# EAGLE design H-bro_gear (EAGLE 6.3)
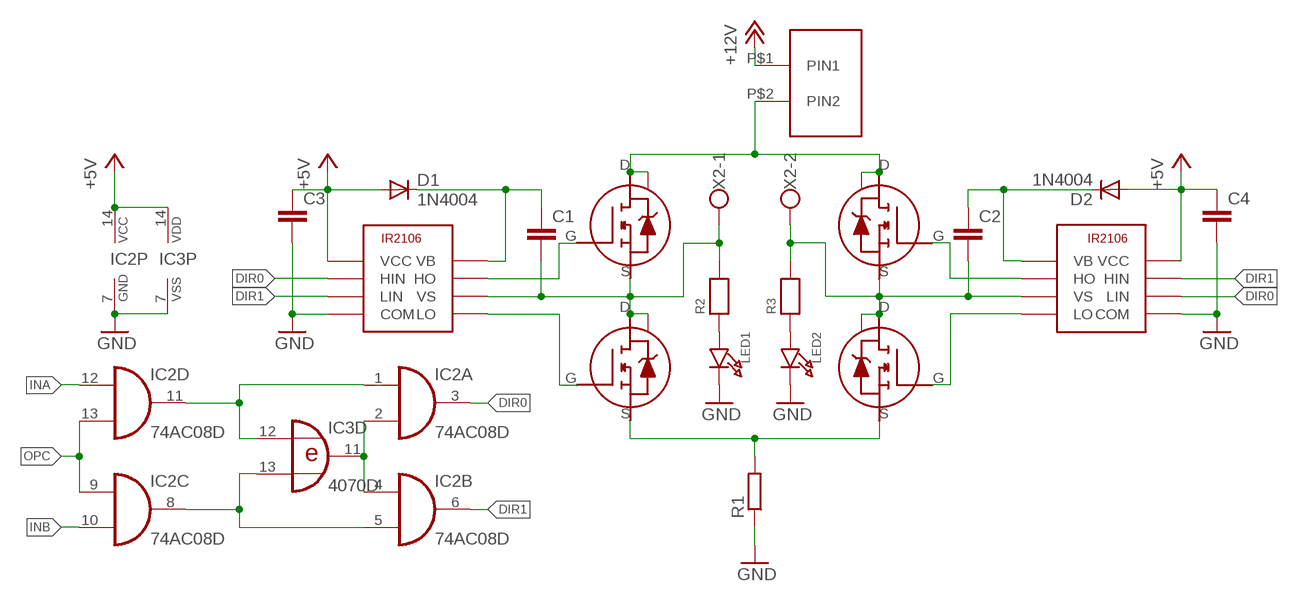
[diagram p0: schematic, sheet 1]

## Parts
C1  C-EU050-025X075  [C050-025X075]
C2  C-EU050-025X075  [C050-025X075]
C3  C-EU050-025X075  [C050-025X075]
C4  C-EU050-025X075  [C050-025X075]
D1  1N4004  [DO41-10]
D2  1N4004  [DO41-10]
IC2  74AC08D  [SO14]
IC3  4070D  [SO14]
LED1  LED1206  [CHIPLED_1206]
LED2  LED1206  [CHIPLED_1206]
R1  R-EU_0309/12  [0309/12]
R2  RESISTOR_0603  [_0603]
R3  RESISTOR_0603  [_0603]
U$1  IR2106  [IR2106]
U$2  IR2106  [IR2106]
U$3  STU95N5  [STU95N5]
U$4  STU95N5  [STU95N5]
U$5  STU95N5  [STU95N5]
U$6  STU95N5  [STU95N5]
U$7  LITTE_FUSE  [LITTE_FUSE_PAC]
X2  W237-102  [W237-102]

## Nets
+5V: C3.1 C4.1 D1.A D2.A IC2.14(P:VCC) IC3.14(P:VDD) U$1.VCC U$2.VCC
+12V: U$7.P$1(PIN1)
DIR0: IC2.3(A:O) U$1.HIN U$2.LIN
DIR1: IC2.6(B:O) U$1.LIN U$2.HIN
GND: C3.2 C4.2 IC2.7(P:GND) IC3.7(P:VSS) LED1.C LED2.C R1.1 U$1.COM U$2.COM
INA: IC2.12(D:I0)
INB: IC2.10(C:I1)
N$1: U$1.HO U$3.G
N$2: U$1.LO U$4.G
N$3: U$2.HO U$6.G
N$4: U$2.LO U$5.G
N$6: C1.2 R2.2 U$1.VS U$3.S U$4.D U$4.TAB X2.1
N$7: C2.2 R3.2 U$2.VS U$5.D U$5.TAB U$6.S X2.2
N$9: U$3.D U$3.TAB U$6.D U$6.TAB U$7.P$2(PIN2)
N$10: C1.1 D1.C U$1.VB
N$11: R1.2 U$4.S U$5.S
N$13: C2.1 D2.C U$2.VB
N$15: IC2.2(A:I1) IC2.4(B:I0) IC3.11(D:O)
N$16: IC2.1(A:I0) IC2.11(D:O) IC3.12(D:I0)
N$17: IC2.5(B:I1) IC2.8(C:O) IC3.13(D:I1)
N$18: LED1.A R2.1
N$20: LED2.A R3.1
OPC: IC2.9(C:I0) IC2.13(D:I1)
Unconnected: IC3.1(A:I0) IC3.2(A:I1) IC3.3(A:O) IC3.4(B:O) IC3.5(B:I0) IC3.6(B:I1) IC3.8(C:I0) IC3.9(C:I1) IC3.10(C:O)

## Library data of the parts
C1-C4 = rcl:C-EU: CAPACITOR, European symbol
D1 D2 = diode:1N4004: DIODE general purpose rectifier, 1 A
IC2 = 74xx-eu:74*08: Quad 2-input AND gate
IC3 = 40xx:4070: Quad 2-input XOR
LED1 LED2 = microbuilder:LED: LED 0603 - 0603 Surface Mount Package 2mA: Green LED - Low Power (3.9mcd, 2ma, 1.7Vf) - Digikey: 475-2709-2-ND Orange LED - Low Power (9.8mcd, 2ma, 1.8Vf) - Digikey: 475-1194-2-ND Red LED - Low Power (5mcd, 2ma, 1.8Vf) - Digikey: 475-1195-2-ND Yellow LED - Low Power (7mcd, 2ma, 1.8Vf) - Digikey: 475-1196-2-ND 5mA: Blue LED - Low Power (17mcd, 5ma, 2.9Vf) - Digikey: LNJ937W8CRACT-ND 0805 - 0805 Surface Mount Package 2mA: Red LED (8.8mcd, 2mA, 1.8Vf, Clear) - Low Power [Digikey: 475-2510-1-ND] Green LED (5mcd, 2mA, 1.8Vf, Clear) - Low Power [Digikey: 475-2730-1-ND] Yellow LED (11.3mcd, 2mA, 1.8Vf, Clear) - Low Power [Digikey: 475-2555-1-ND] 20mA: Red LED (104mcd, 20mA, Diffused) - LS R976 [Digikey: 475-1278-6-ND] Red LED (12mcd, 20mA, 2.0Vf, Clear) - APT2012EC [Digikey: 754-1128-1-ND] Green LED (15mcd, 20mA, 2.2Vf, Clear) - APT2012GC [Digikey: 754-1131-1-ND] Orange LED (160mcd, 20mA, 2.1Vf, Clear) - APT2012SECK [Digikey: 754-1130-1-ND] 1206 - 1206 Surface Mount Package Green LED (26mcd, 20mA, Diffused) - LG N971 [Digikey: 475-1407-6-ND] Red LED (15mcd, 20mA, Diffused) - LH N974 [Digikey: 475-1416-6-ND]
R1 = resistor:R-EU_: RESISTOR, European symbol
R2 R3 = microbuilder:RESISTOR: Resistors 0402 - 0402 Surface Mount Package 22 Ohm 1% 1/16W [Digikey: 311-22.0LRTR-ND] 33 Ohm 5% 1/16W 1.0K 5% 1/16W 1.5K 5% 1/16W 2.0K 1% 1/16W 10.0K 1% 1/16W [Digikey: 311-10.0KLRTR-ND] 10.0K 5% 1/16W [Digikey: RMCF0402JT10K0TR-ND] 12.1K 1% 1/16W [Digikey: 311-22.0LRTR-ND] 100.0K 5% 1/16W 0603 - 0603 Surface Mount Package 0 Ohm 1/10 Watt 1% Resistor 15 Ohm 1/10 Watt 1% Resistor 33 Ohm 1/10 Watt 1% Resistor 49.9 Ohm 1/10 Watt 1% Resistor 100 Ohm 1/10 Watt 1% Resistor 150 Ohm 1/10 Watt 1% Resistor 240 Ohm 1/10 Watt 1% Resistor 390 Ohm 1/10 Watt 1% Resistor 560 Ohm 1/10 Watt 1% Resistor 680 Ohm 1/10 Watt 1% Resistor 750 Ohm 1/10 Watt 1% Resistor 1.0K Ohm 1/10 Watt 1% Resistor 1.5K Ohm 1/10 Watt 1% Resistor 2.0K Ohm 1/10 Watt 1% Resistor 2.2K Ohm 1/10 Watt 1% Resistor 3.3K Ohm 1/10 Watt 1% Resistor 4.7K Ohm 1/10 Watt 1% Resistor 10.0K Ohm 1/10 Watt 1% Resistor 12.0K Ohm 1/10 Watt 1% Resistor 12.1K Ohm 1/10 Watt 1% Resistor 20.0K Ohm 1/10 Watt 1% Resistor 33.0K Ohm 1/10 Watt 1% Resistor 100.0K Ohm 1/10 Watt 1% Resistor 0805 - 0805 Surface Mount Package 0 Ohm 1/8 Watt 1% Resistor 33 Ohm 1/8 Watt 1% Resistor 100 Ohm 1/8 Watt 1% Resistor 150 Ohm 1/8 Watt 1% Resistor 200 Ohm 1/8 Watt 1% Resistor 240 Ohm 1/8 Watt 1% Resistor 330 Ohm 1/8 Watt 1% Resistor 390 Ohm 1/8 Watt 1% Resistor 470 Ohm 1/8 Watt 1% Resistor 1.0K Ohm 1/8 Watt 1% Resistor 1.5K Ohm 1/8 Watt 1% Resistor 2.0K Ohm 1/8 Watt 1% Resistor 4.7K Ohm 1/8 Watt 1% Resistor 5.1K Ohm 1/8 Watt 1% Resistor 5.6K Ohm 1/8 Watt 1% Resistor 10.0K Ohm 1/8 Watt 1% Resistor 22.0K Ohm 1/8 Watt 1% Resistor 33.0K Ohm 1/8 Watt 1% Resistor 100K Ohm 1/8 Watt 1% Resistor 1206 - 1206 Surface Mount Package 2012 - 2010 Surface Mount Package 0.11 Ohm 1/2 Watt 1% Resistor - Digikey: RHM.11UCT-ND
U$1 U$2 = IR2106:IR2106; DEVICE: IR2106
U$3-U$6 = Brushless-motor-controller:STU95N5
U$7 = unicorn_v2:LITTE_FUSE
X2 = con-wago-500:W237-102: WAGO SCREW CLAMP; MPN: 237-102; OC_FARNELL: unknown; OC_NEWARK: 70K9898

## Board
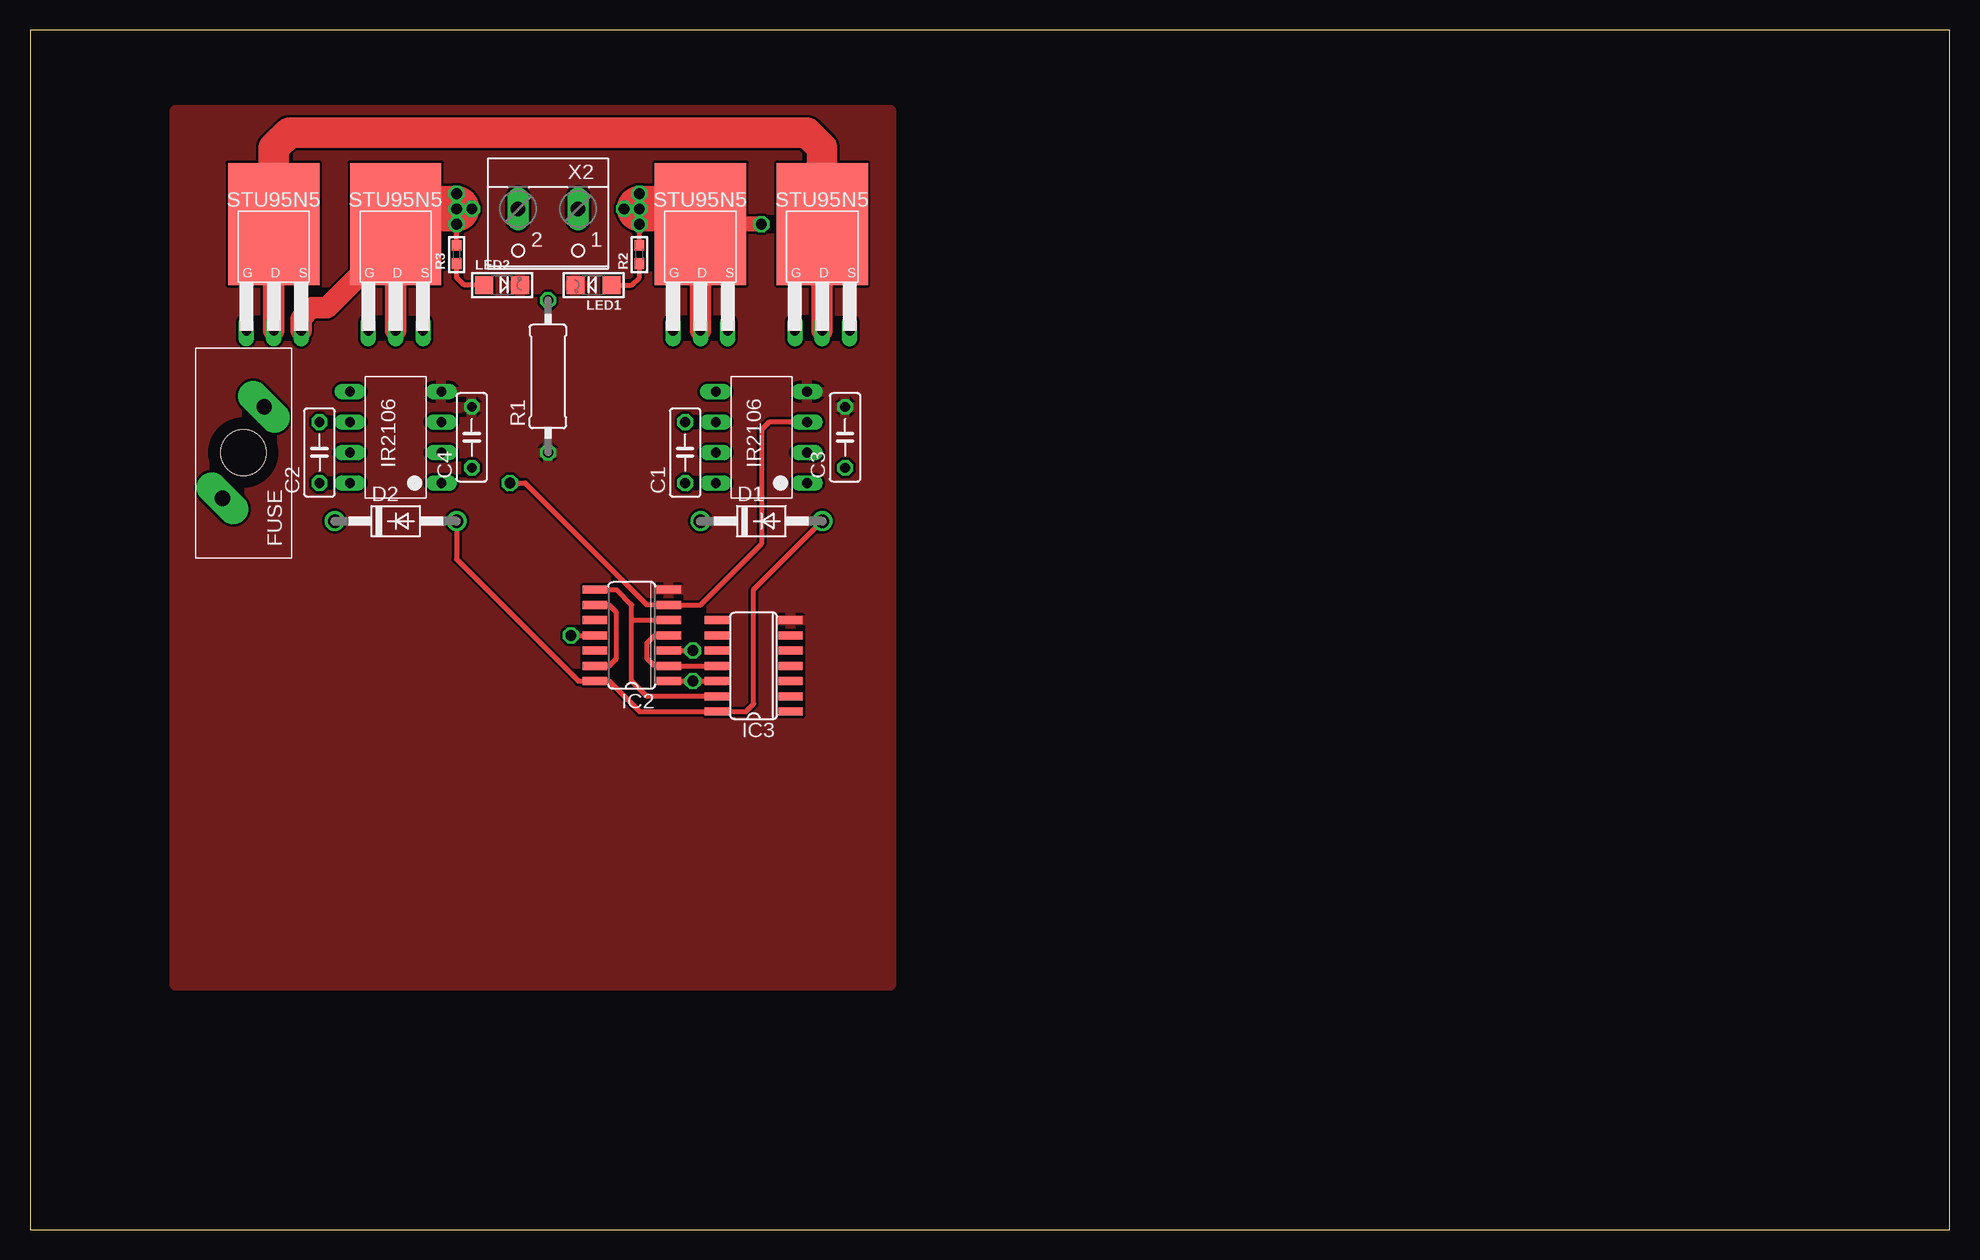
[diagram p1: board, top side]
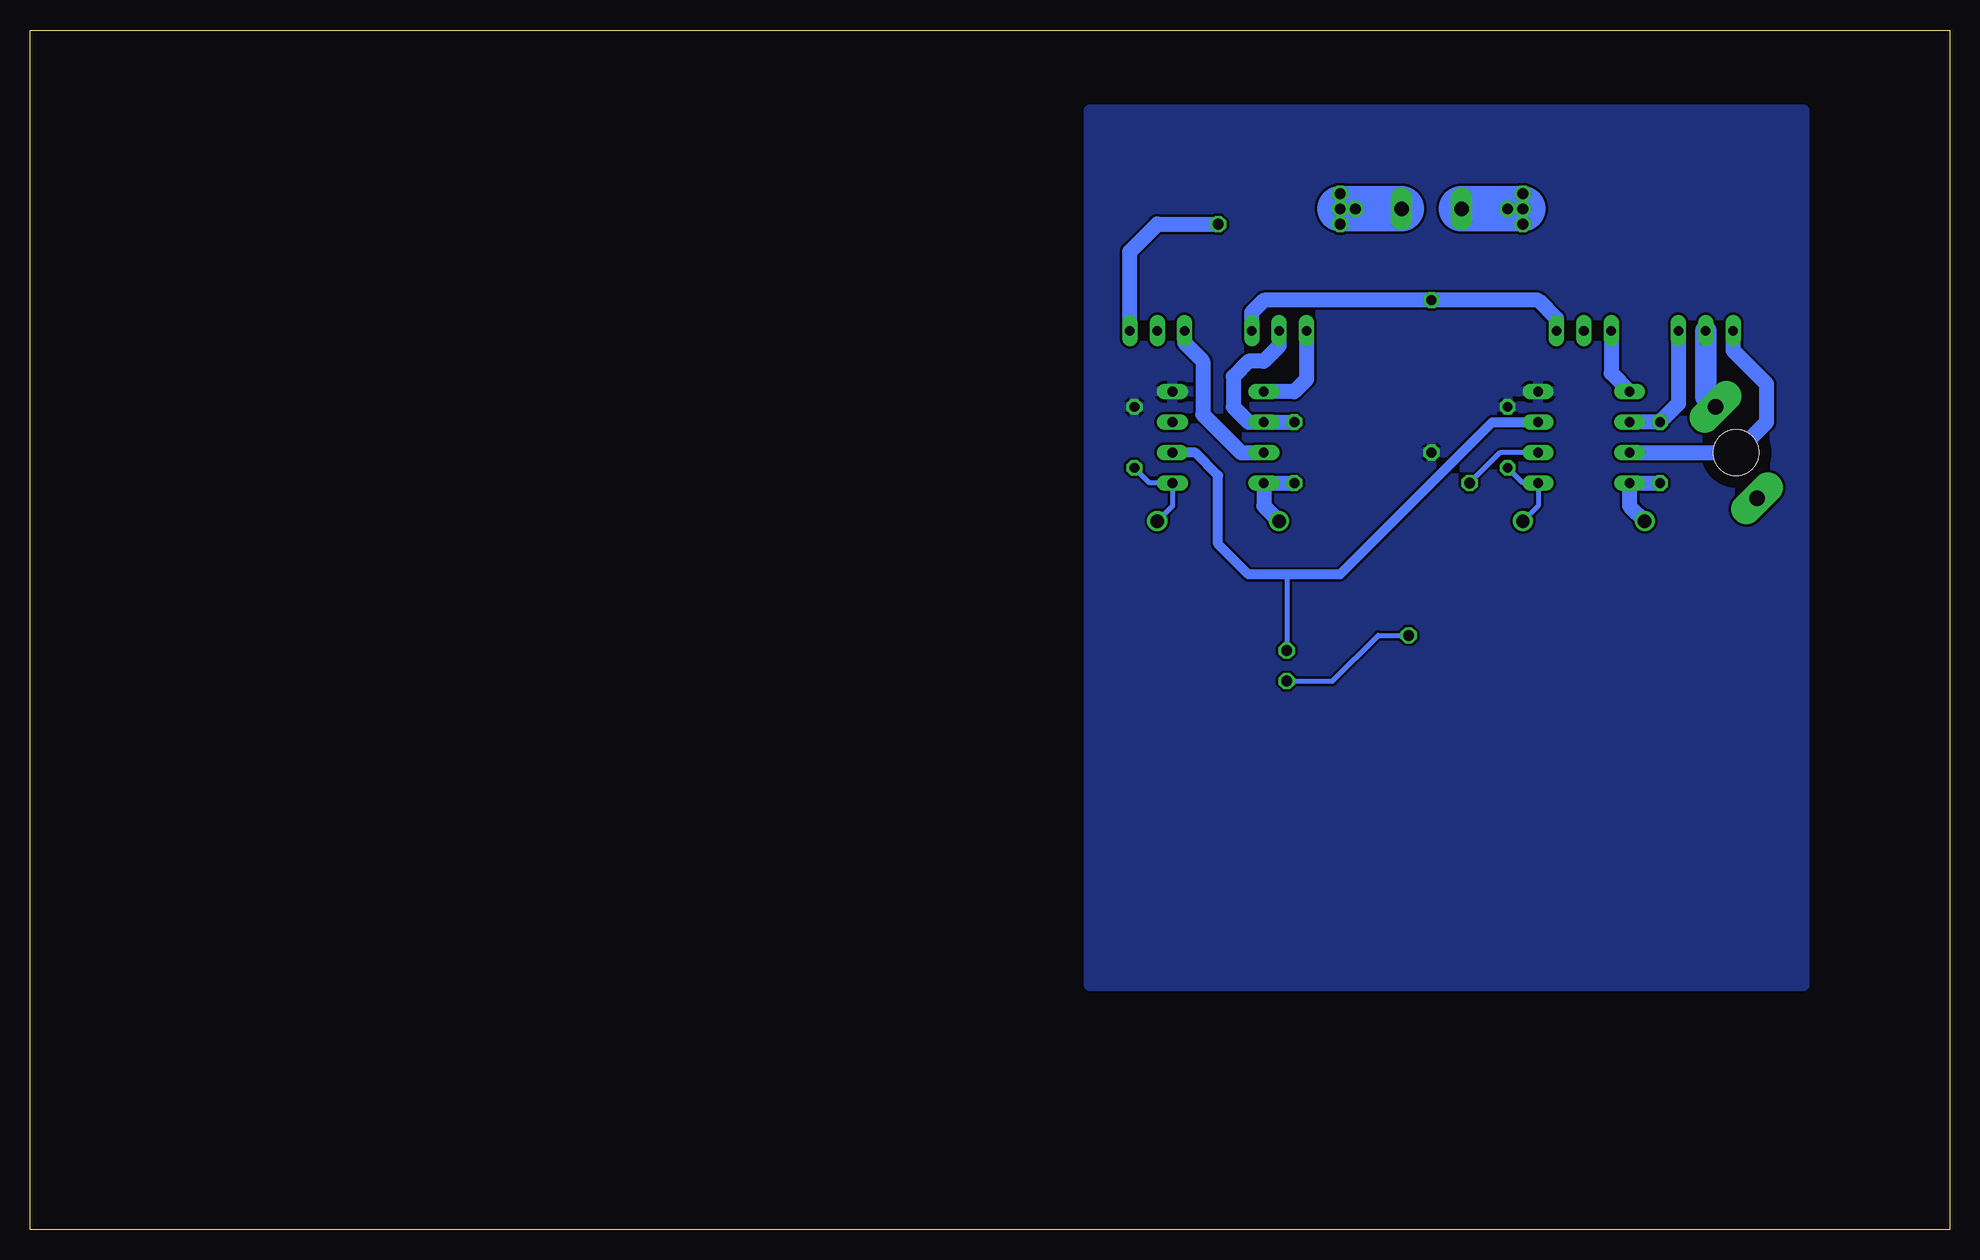
[diagram p2: board, bottom side, seen from below]

Size 160 x 100 mm. Coordinates in mm from the lower left corner, seen from the top.
Outline: 0,0 160,0 160,100 0,100 0,0
Copper layers (1*16): Top 0.035mm / dielectric 1.5mm / Bottom 0.035mm
Design rules "default": minimum track width 10mil, minimum drill 24mil, track to track 8mil, track to pad 8mil, pad to pad 8mil, via to via 8mil, smd to smd 8mil, copper to edge 40mil, drill to drill 8mil, minimum pad ring 10mil, minimum via ring 8mil, stop-mask expansion 4mil, vias tented up to drill 0mil, thermal gap 10mil

### Footprints (pad centres in the part's own frame; a part is rotated, then mirrored left to right if it is on the bottom)
C050-025X075 = drill 0.813 octagon: 1 -2.54,0; 2 2.54,0
DO41-10 = drill 1.118: A 5.08,0; C -5.08,0
SO14 = smd 0.66 x 2.032: 1 -3.81,-3.073; 2 -2.54,-3.073; 3 -1.27,-3.073; 4 0,-3.073; 5 1.27,-3.073; 6 2.54,-3.073; 7 3.81,-3.073; 8 3.81,3.073; 9 2.54,3.073; 10 1.27,3.073; 11 0,3.073; 12 -1.27,3.073; 13 -2.54,3.073; 14 -3.81,3.073
CHIPLED_1206 = smd 1.5 x 1.5: A 0,-1.496; C 0,1.496
0309/12 = drill 0.813 octagon: 1 -6.35,0; 2 6.35,0
_0603 = smd 0.9 x 0.8: 1 -0.762,0; 2 0.762,0
IR2106 = drill 0.8 long: COM 3.81,-3.81; HIN -1.27,-3.81; HO -1.27,3.81; LIN 1.27,-3.81; LO 3.81,3.81; VB -3.81,3.81; VCC -3.81,-3.81; VS 1.27,3.81
STU95N5 = drill 0.8 long: D 0,0; G -2.28,0; S 2.28,0 | smd 7.62 x 10.16: TAB 0,8.89
LITTE_FUSE_PAC = drill 1.27 pad 2.54 long: P$1 -1.73,-3.81; P$2 1.73,3.81 | hole 3.78: 0,0
W237-102 = drill 1.194 long: 1 -2.5,-1.27; 2 2.5,-1.27

### Placement (x,y rotation side)
C1  54.61,64.77 90 top
C2  24.13,64.77 90 top
C3  67.94,66.04 90 top
C4  36.83,66.04 90 top
D1  60.96,59.05 0 top
D2  30.48,59.05 0 top
IC2  50.16,49.53 90 top
IC3  60.33,46.99 90 top
LED1  46.99,78.74 90 top
LED2  39.37,78.74 270 top
R1  43.18,71.12 90 top
R2  50.8,81.28 90 top
R3  35.56,81.28 90 top
U$1  60.96,66.04 90 top
U$2  30.48,66.04 90 top
U$3  66.04,74.93 0 top
U$4  55.88,74.93 0 top
U$5  30.48,74.93 0 top
U$6  20.32,74.93 0 top
U$7  17.78,64.77 0 top
X2  43.18,83.82 180 top

### Tracks (layer width: path | path; a pad name or v marks a point on that pad's centre or on a via)
+5V
  Top 0.406: D2.A 35.56,55.88 45.72,45.72 IC2.14 48.26,45.72 50.8,43.18 IC3.14 59.69,43.18 60.33,43.81 60.33,53.34 D1.A
  Bottom 0.406: D2.A 34.29,60.33 U$2.VCC 35.56,62.23 C4.1 | D1.A 64.77,60.33 U$1.VCC 66.67,62.23 C3.1
DIR0  (via drill 0.9)
  Top 0.406: IC2.3 v55.24,48.26
  Bottom 0.406: 55.24,54.61 v55.24,48.26
  Bottom 0.813: U$1.HIN 62.87,64.77 60.96,62.87 60.96,57.15 58.42,54.61 55.24,54.61 50.8,54.61 38.1,67.31 U$2.LIN
DIR1  (via drill 0.9)
  Top 0.406: U$1.LIN 61.59,67.31 60.96,66.67 60.96,57.15 55.88,52.07 IC2.6 51.44,52.07 41.27,62.23 v40.01,62.23
  Bottom 0.406: U$2.HIN 37.47,64.77 v40.01,62.23
GND
  pour Top: 12.06,93.34 71.75,93.34 71.75,20.32 12.06,20.32
  pour Bottom: 12.06,93.34 71.75,93.34 71.75,20.32 12.06,20.32
N$1
  Bottom 1.27: U$3.G 63.76,73.92 62.23,72.39 62.23,67.94 59.05,64.77 U$1.HO
N$2
  Bottom 1.27: U$4.G 53.6,70.86 54.61,69.85 U$1.LO
N$3
  Bottom 1.27: U$2.HO 17.78,64.77 15.24,67.31 15.24,70.48 18.04,73.28 U$6.G
N$4
  Bottom 1.27: U$5.G 28.2,71.38 U$2.LO
N$5  (via drill 0.9)
  other vias: 35.56,86.36
N$6  (via drill 0.9)
  Top 0.406: 49.4,84.96 v49.53,85.09 | R2.2 v50.8,85.09
  Top 1.27: v60.96,83.82 U$4.TAB
  Top 1.778: U$4.D U$4.TAB
  Top 3.81: U$4.TAB 54.61,85.09 v50.8,85.09
  Bottom 1.27: U$4.D 55.88,73.66 57.15,72.39 58.42,72.39 59.69,71.12 59.69,68.58 58.42,67.31 U$1.VS C1.2 | U$3.S 68.32,81.54 66.04,83.82 v60.96,83.82
  Bottom 3.81: v50.8,85.09 v49.53,85.09 X2.1
N$7  (via drill 0.9)
  Top 0.406: 36.96,84.96 v36.83,85.09 | R3.2 v35.56,85.09
  Top 1.27: U$5.TAB 30.48,83.19 30.48,82.55
  Top 1.676: 30.48,83.19 30.48,81.92 29.84,81.92
  Top 1.778: U$6.S 22.6,75.94 23.5,76.83 24.77,76.83 29.84,81.92 | U$5.D 30.48,81.92
  Top 3.81: U$5.TAB 31.75,85.09 v35.56,85.09
  Bottom 1.27: U$6.S 22.6,68.84 C2.2 U$2.VS
  Bottom 3.81: v35.56,85.09 v36.83,85.09 X2.2
N$8  (via drill 0.9)
  other vias: 35.56,83.82
N$9
  Top 0.813: U$3.TAB 66.36,84.14
  Top 1.778: U$3.D U$3.TAB | U$6.D U$6.TAB
  Top 2.54: U$6.TAB 20.32,90.17 21.59,91.44 64.77,91.44 66.04,90.17 66.04,84.45 66.36,84.14 66.67,83.82
  Bottom 1.778: U$7.P$2 20.32,69.39 U$6.D
N$10
  Bottom 1.27: D1.C 57.15,60.33 U$1.VB C1.1
N$11
  Bottom 1.27: U$4.S 58.16,76.46 57.15,77.47 R1.2 34.29,77.47 32.76,75.94 U$5.S
N$12  (via drill 0.9)
  other vias: 50.8,86.36
N$13
  Bottom 1.27: D2.C 26.67,60.33 U$2.VB C2.1
N$14  (via drill 0.9)
  other vias: 50.8,83.82
N$15
  Top 0.406: IC2.4 52.07,49.53 51.44,48.9 51.44,47.62 52.07,46.99 IC2.2 IC3.11
N$16  (via drill 0.9)
  Top 0.406: IC3.12 v55.24,45.72 IC2.1 | v45.09,49.53 IC2.11
  Bottom 0.406: v55.24,45.72 51.44,45.72 47.62,49.53 v45.09,49.53
N$17
  Top 0.406: IC3.13 51.44,44.45 50.16,45.72 50.16,50.8 | 50.16,50.8 IC2.5 | IC2.8 48.9,53.34 50.16,52.07 50.16,50.8
N$18
  Top 0.406: LED1.A 50.16,78.74 50.8,79.38 R2.1
N$20
  Top 0.406: LED2.A 36.2,78.74 35.56,79.38 R3.1
OPC
  Top 0.406: IC2.13 48.26,46.99 48.9,47.62 48.9,51.44 48.26,52.07 IC2.9